# EAGLE board All-in-one Starter Kit for Arduino Nano R4 V1.0 (EAGLE 9.6.2)
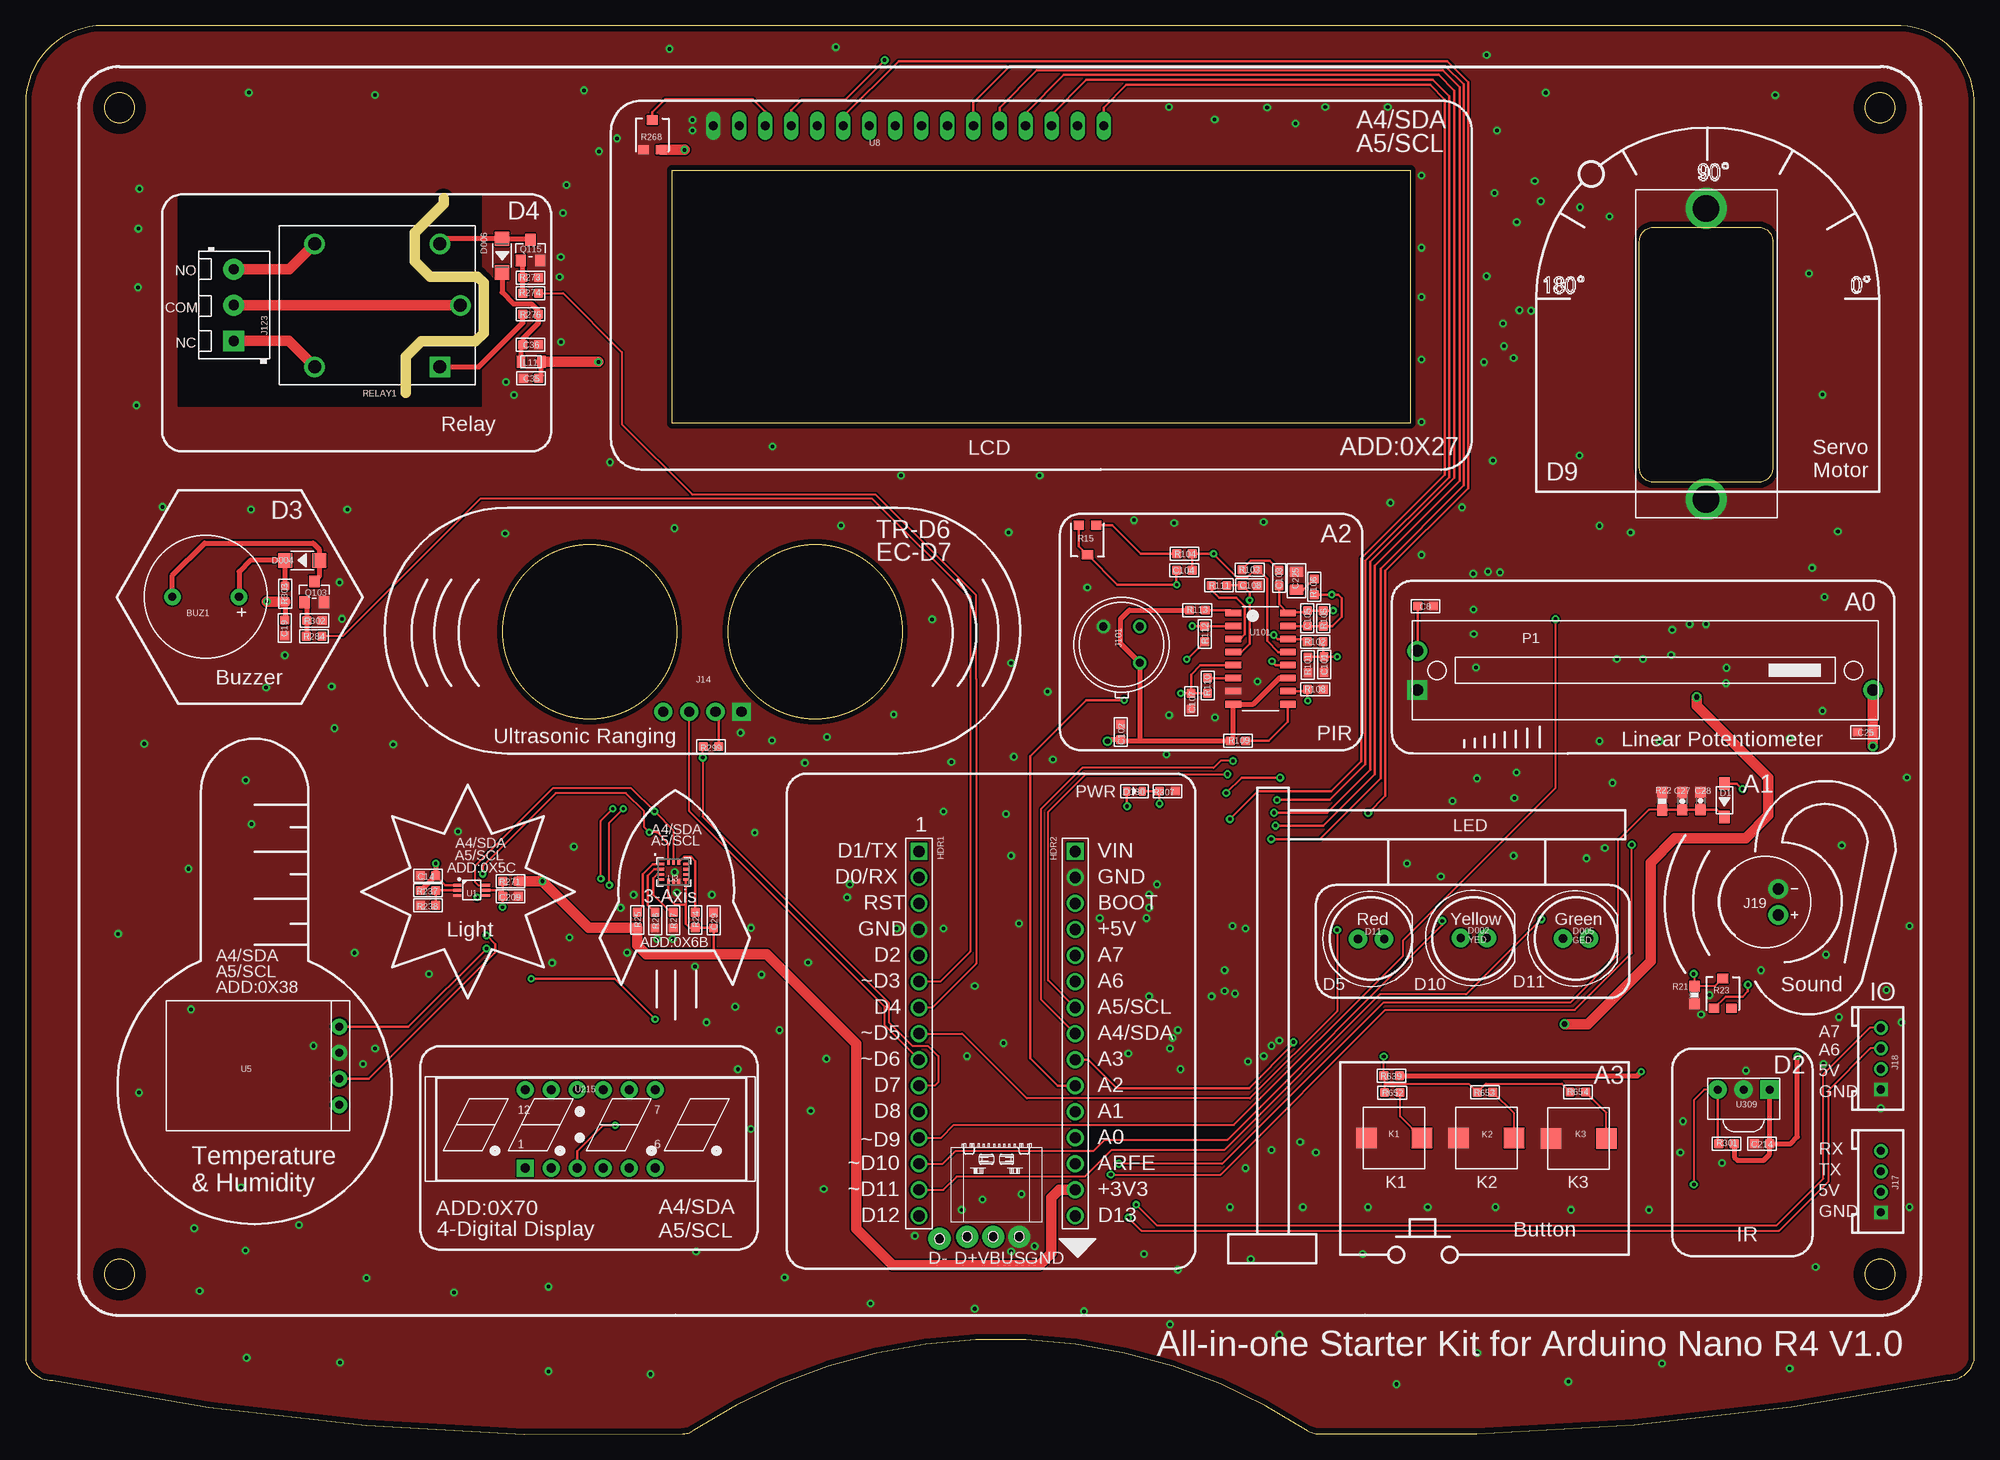
[diagram p2: board, top side]
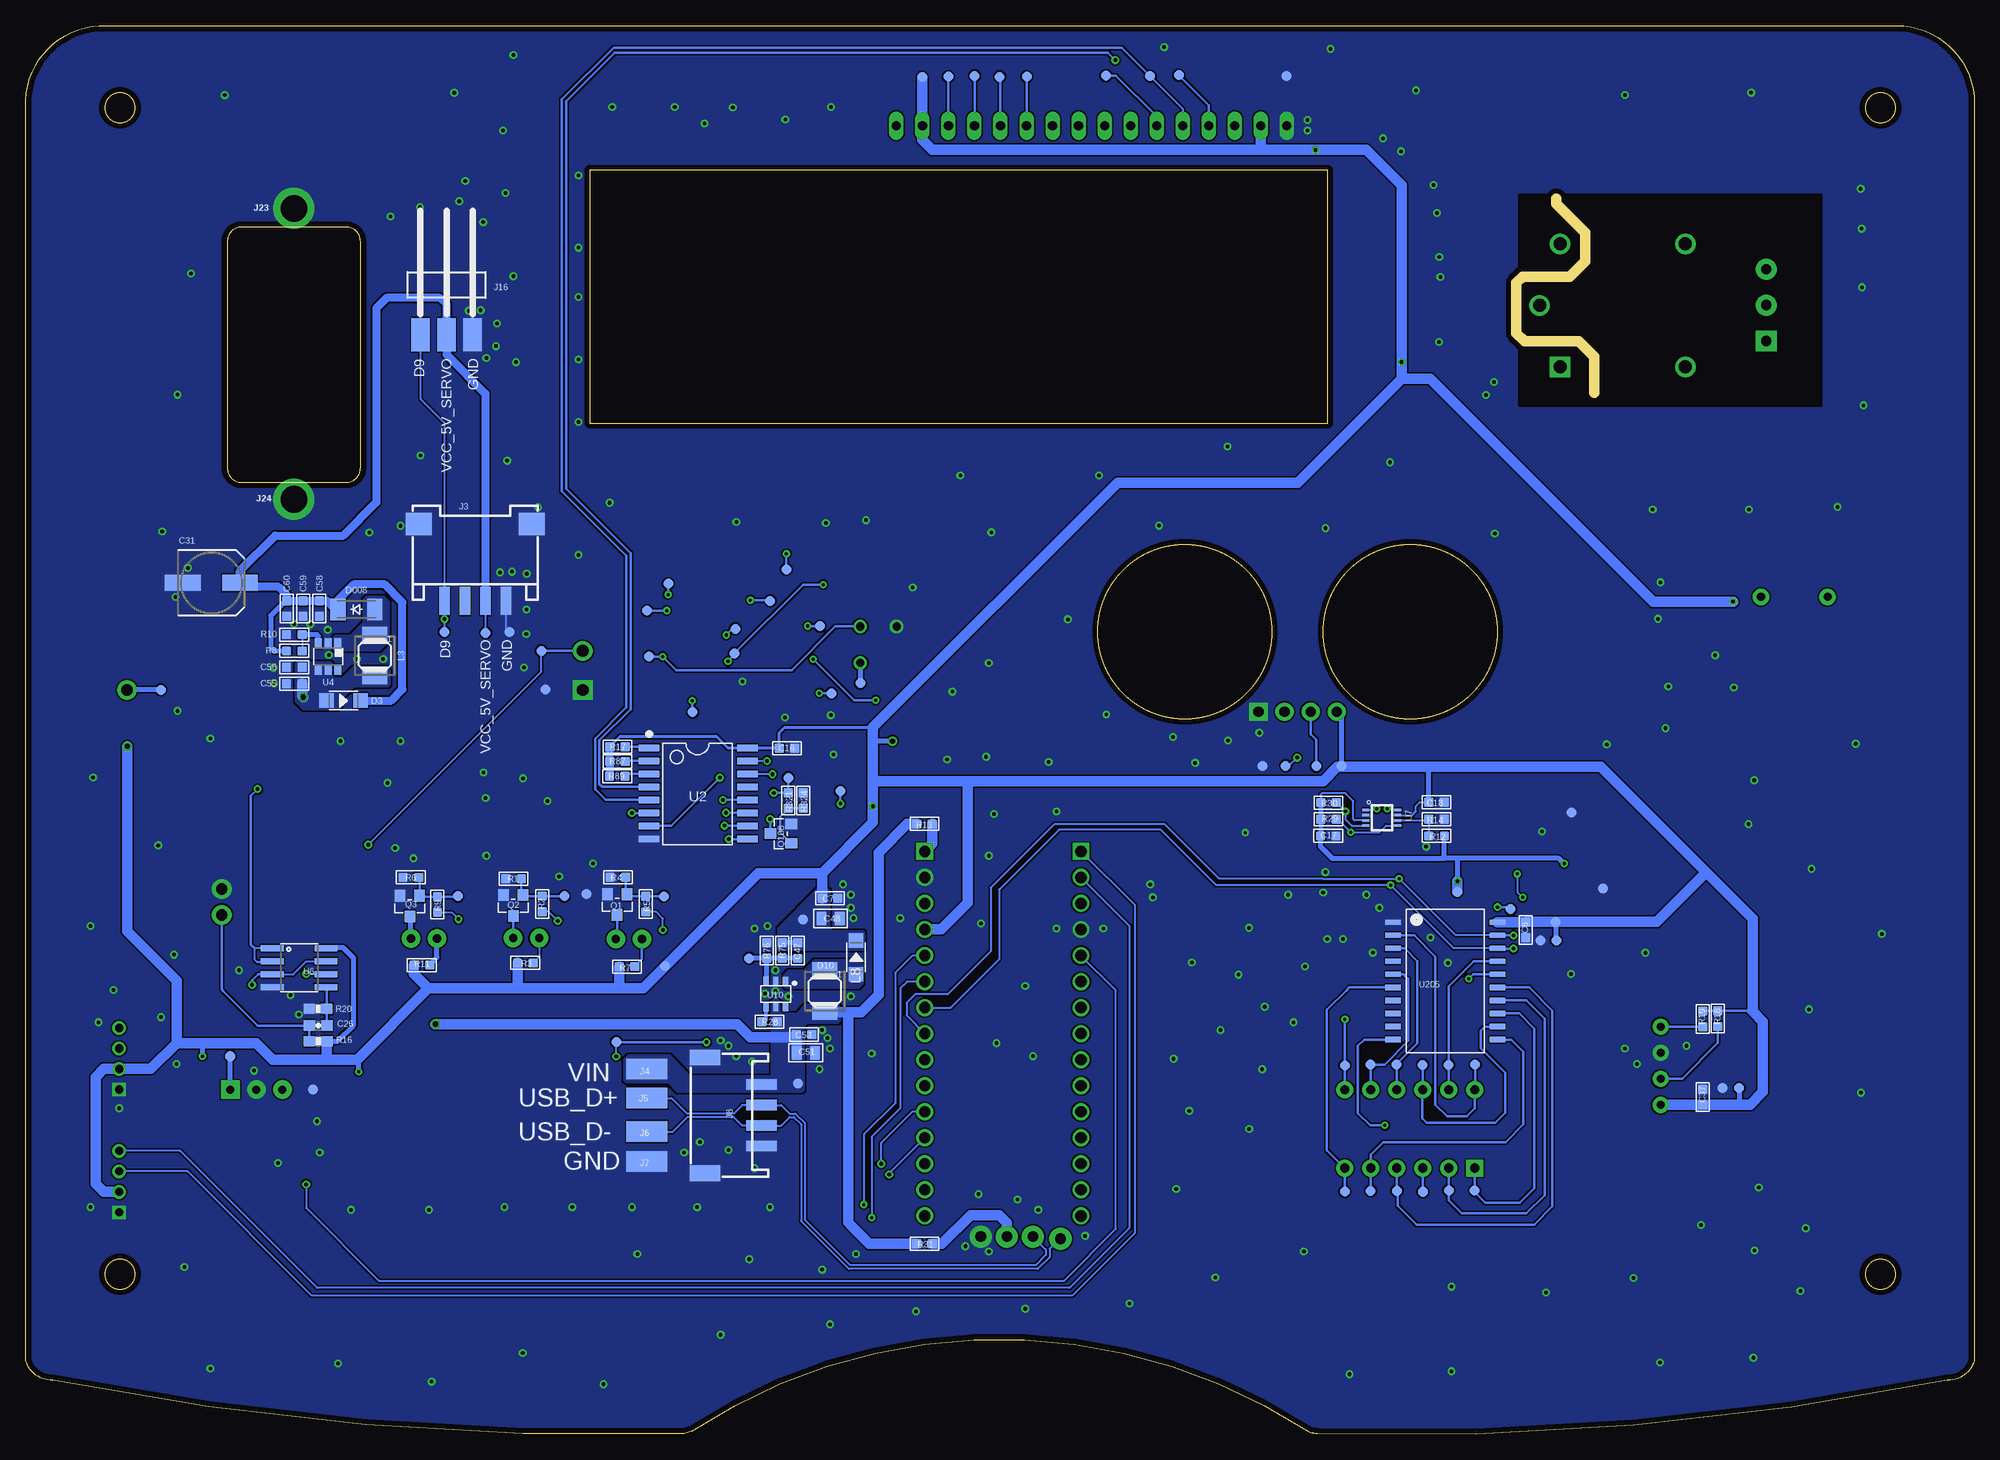
[diagram p3: board, bottom side, seen from below]

Size 190.12 x 137.4 mm. Coordinates in mm from the lower left corner, seen from the top.
Outline: 37.08,101.61 37.08,105.11 38.58,106.61 43.78,106.61
Outline: 44.68,112.31 44.08,112.91 39.48,112.91 37.98,114.41 37.98,117.21 40.78,120.01 40.78,120.51
Outline: 44.68,112.21 44.68,107.41 43.88,106.61
Outline: 190.12,7.17 190.12,129.4 arc90 182.92,137.4 7.59,137.4 arc90 0,129.81 0,7.17 arc74 2.63,5.24 arc13 64.11,0.02 arc30 65.1,0.3 arc-66 125.16,0.28 arc30 126.16,0.02 arc13 187.46,5.24 arc74 190.12,7.17
Outline: 170.45,116.35 170.45,94.25 arc-90 169.05,92.85 158.85,92.85 arc-90 157.45,94.25 157.45,116.35 arc-90 158.85,117.75 169.05,117.75 arc-90 170.45,116.35
Outline: circle at 9.16,15.58 radius 1.45
Outline: circle at 9.16,129.39 radius 1.45
Outline: circle at 180.92,15.58 radius 1.45
Outline: circle at 180.92,129.39 radius 1.45
Copper layers (1*16): Top 0.035mm / dielectric 1.5mm / Bottom 0.035mm
Design rules "default *": minimum track width 8mil, minimum drill 0.3mm, track to track 6mil, track to pad 6mil, pad to pad 6mil, via to via 6mil, smd to smd 0mil, copper to edge 20mil, drill to drill 6mil, minimum pad ring 10mil, minimum via ring 8mil, stop-mask expansion 4mil, vias tented up to drill 100mil, thermal gap 0mil
Net classes: 1 PWR: width 0.15 mm, drill 0.25 mm; 2 gnd: width 0.15 mm, drill 0.3 mm, clearance 0.152 mm
tKeepout: area 147.3,94 to 180.9,127.6
tRestrict: area 6.7,13.1 to 11.7,18.1; area 6.7,126.9 to 11.7,131.9; area 178.4,13.1 to 183.4,18.1; area 178.4,126.9 to 183.4,131.9

## Footprints (pad centres in the part's own frame; a part is rotated, then mirrored left to right if it is on the bottom)
BUZZER-D12MM-DIP2 = drill 0.8 pad 1.6: 1 -3.25,0; 2 3.25,0
0603 = smd 0.889 x 0.889: 1 -0.762,0; 2 0.762,0
C0603 = smd 0.889 x 0.889: 1 -0.762,0; 2 0.762,0
0603-CAP = smd 1.1 x 1: 1 -0.85,0; 2 0.85,0
SANYO-OSCON_SMD_C6 = smd 3.5 x 1.6: + 2.8,0; - -2.8,0
C0805 = smd 1.016 x 1.397: 1 -0.889,0; 2 0.889,0
0805 = smd 1.016 x 1.397: 1 -0.889,0; 2 0.889,0
SOD123-2.7X1.6 = smd 1.2 x 1.02: 1 -1.635,0; 2 1.635,0
LED-8MM = drill 0.8 pad 1.8: 1 -1.27,0; 2 1.27,0
D_SOD123FL = smd 1.397 x 1.397: + -1.651,0; - 1.651,0
D_SOD123 = smd 1.397 x 1.397: + -1.651,0; - 1.651,0
SOD-123_MINI-SMA = smd 1.5 x 2.1: A 1.8,0; C -1.8,0
LED_0603_SMT = smd 0.762 x 0.889: 1 -0.762,0; 2 0.762,0
HDR-TH_15P-P2.54-V-F = drill 1.1 square: 1 0,0 | drill 1.1: 2 2.54,0; 3 5.08,0; 4 7.62,0; 5 10.16,0; 6 12.7,0; 7 15.24,0; 8 17.78,0; 9 20.32,0; 10 22.86,0; 11 25.4,0; 12 27.94,0; 13 30.48,0; 14 33.02,0; 15 35.56,0
A_XBJ_CONNECTOR_4P-SMD-2.0-90D = smd 1.01 x 2.74: 1 -3,-0.1; 2 -1,-0.1; 3 1,-0.1; 4 3,-0.1 | smd 2.54 x 2.184: SS1 -5.5,7.4; SS2 5.5,7.4
TP-SMD-2X4MM = smd 4 x 2: 1 0,0
PH2.0-4P = smd 1 x 3: 1 -3,2.762; 2 -1,2.762; 3 1,2.762; 4 3,2.762 | smd 1.524 x 3: 5 -5.65,-2.763; 6 5.65,-2.763
CROWPI_POW_ULTRA = drill 1 pad 1.778 square: P$1 3.81,0 | drill 1 pad 1.778: P$2 1.27,0; P$3 -1.27,0; P$4 -3.81,0
CON-PZ-2.54MM-1*3P-WT = smd 1.8 x 3.2: 1 -2.54,0; 2 0,0; 3 2.54,0
2.0_1X4 = drill 0.8 pad 1.27 square: 1 -3,0 | drill 0.8 pad 1.27: 2 -1,0; 3 1,0; 4 3,0
TEMPLATE_2P-D8.9MM = drill 1.1 pad 1.93: 1 -1.27,1.27; 2 -1.27,-1.27
1X01_2.6MM = drill 2.6 pad 4: 1 0,0
3P-D8.1MM = drill 0.8: 1 1.778,1.778; 2 -1.778,1.778; 3 -1.778,-1.778
3.5MM*3P = drill 1.016 pad 2.032 square: 1 -3.5,0 | drill 1.016 pad 2.032: 2 0,0; 3 3.5,0
BUTTON_2P = smd 2 x 2: P$1 0.3,0; P$2 5.7,0
MS42 = smd 2.4 x 1.5: 1 0,2.05; 2 0,-2.05
201209 = smd 0.8 x 1.2: 1 -1,0; 2 1,0
3P-SQUA-45.6X10X5.8H = drill 1.143 pad 1.905 square: 1 -22.225,-1.905 | drill 1.143 pad 1.905: 2 -22.225,1.905; 3 22.225,-1.905
PAD-1.0MM = smd 1 x 1: P$1 0,0
SOT23@1 = smd 1.016 x 1.143: 1 -0.95,-1.016; 2 0.95,-1.016; 3 0,1.016
R0603 = smd 0.889 x 0.889: 1 -0.762,0; 2 0.762,0
3P-SMD-SQUA-3.6X3.3 = smd 1 x 0.9: 1 -0.85,-1.45; 3 0.85,-1.45 | smd 1.1 x 0.9: 2 0,1.45
0603-RES = smd 1.1 x 1: 1 -0.85,0; 2 0.85,0
R0603-SP = smd 0.889 x 0.889: 1 -0.762,0; 2 0.762,0
REY5-6-19.1X15.5X15.3MM = drill 1.3 pad 2 square: 1 -6.1,6 | drill 1.3 pad 2: 2 -8.1,0; 3 -6.1,-6; 4 6.1,6; 5 6.1,-6
POGOPIN_4 = drill 1.05 pad 2.15: 1 0,0; 2 2.54,0; 3 5.08,0; 4 7.769,0.214
BH1750-WSOF-6 = smd 0.8 x 0.27: 1 -1.4,0.5; 2 -1.4,0; 3 -1.4,-0.5; 4 1.4,-0.5; 5 1.4,0; 6 1.4,0.5
SO-16-300MIL = smd 0.635 x 2: P$1 0,0; P$2 1.27,0; P$3 2.54,0; P$4 3.81,0; P$5 5.08,0; P$6 6.35,0; P$7 7.62,0; P$8 8.89,0; P$9 8.89,9.6; P$10 7.62,9.6; P$11 6.35,9.6; P$12 5.08,9.6; P$13 3.81,9.6; P$14 2.54,9.6; P$15 1.27,9.6; P$16 0,9.6
LGA-14L = smd 0.475 x 0.25: 1 -1.163,0.75; 2 -1.163,0.25; 3 -1.163,-0.25; 4 -1.163,-0.75; 8 1.163,-0.75; 9 1.163,-0.25; 10 1.163,0.25; 11 1.163,0.75 | smd 0.25 x 0.475: 5 -0.5,-0.912; 6 0,-0.912; 7 0.5,-0.912; 12 0.5,0.912; 13 0,0.912; 14 -0.5,0.912
DBV_R-PDSO-G6 = smd 0.69 x 0.99: 1 -0.95,-1.29; 2 0,-1.29; 3 0.95,-1.29; 4 0.95,1.3; 5 0,1.3; 6 -0.95,1.3
CROWTAIL-DHT20-V1.0-20211013_DHT20 = drill 0.8 pad 1.6: 1 -3.81,0; 2 -1.27,0; 3 1.27,0; 4 3.81,0
SO08 = smd 0.61 x 2.21: 1 -1.905,-2.616; 2 -0.635,-2.616; 3 0.635,-2.616; 4 1.905,-2.616; 5 1.905,2.616; 6 0.635,2.616; 7 -0.635,2.616; 8 -1.905,2.616
VSSOP-8 = smd 0.25 x 0.7: 1 -0.762,-1.55; 2 -0.254,-1.55; 3 0.254,-1.55; 4 0.762,-1.55; 5 0.762,1.55; 6 0.254,1.55; 7 -0.254,1.55; 8 -0.762,1.55
CROWPI_POW_LCD1206 = drill 0.9 long: P$1 -16.51,3.36; P$2 -13.97,3.36; P$3 -11.43,3.36; P$4 -8.89,3.36; P$5 -6.35,3.36; P$6 -3.81,3.36; P$7 -1.27,3.36; P$8 1.27,3.36; P$9 3.81,3.36; P$10 6.35,3.36; P$11 8.89,3.36; P$12 11.43,3.36; P$13 13.97,3.36; P$14 16.51,3.36; P$15 19.05,3.36; P$16 21.59,3.36
SOT23-6L = smd 0.5 x 0.9: 1 -0.961,-1.212; 2 -0.011,-1.212; 3 0.94,-1.212; 4 0.94,1.288; 5 -0.011,1.288; 6 -0.961,1.288
SOP16 = smd 0.635 x 1.524: 1 0,0; 2 1.27,0; 3 2.54,0; 4 3.81,0; 5 5.08,0; 6 6.35,0; 7 7.62,0; 8 8.89,0; 9 8.89,5.334; 10 7.62,5.334; 11 6.35,5.334; 12 5.08,5.334; 13 3.81,5.334; 14 2.54,5.334; 15 1.27,5.334; 16 0,5.334
HT16K33-SOP20 = smd 1.5 x 0.5: P$1 -5.08,5.08; P$2 -5.08,3.81; P$3 -5.08,2.54; P$4 -5.08,1.27; P$5 -5.08,0; P$6 -5.08,-1.27; P$7 -5.08,-2.54; P$8 -5.08,-3.81; P$9 -5.08,-5.08; P$10 -5.08,-6.35; P$11 5.12,-6.35; P$12 5.12,-5.08; P$13 5.12,-3.81; P$14 5.12,-2.54; P$15 5.12,-1.27; P$16 5.12,0; P$17 5.12,1.27; P$18 5.12,2.54; P$19 5.12,3.81; P$20 5.12,5.08
4-DIGITAL_DISPLAY = drill 0.889 pad 1.651 square: 1 -5.964,-4.229 | drill 0.889 pad 1.651: 2 -3.424,-4.229; 3 -0.884,-4.229; 4 1.656,-4.229; 5 4.196,-4.229; 6 6.736,-4.229; 7 6.736,3.391; 8 4.196,3.391; 9 1.656,3.391; 10 -0.884,3.391; 11 -3.424,3.391; 12 -5.964,3.391
VS1838B-SIP3 = drill 0.8 pad 1.8 square: 1 -2.54,0 | drill 0.8 pad 1.8: 2 0,0; 3 2.54,0

## Placement (x,y rotation side)
BUZ1  BUZZER_1295  [BUZZER-D12MM-DIP2]  17.57,81.68 180 top
C6  100nF  [0603]  43.77,49.17 90 bottom
C7  1uF  [C0603]  111.66,52.29 180 bottom
C8  1uF  [C0603]  136.58,80.78 180 top
C14  1uF  [0603]  39.25,54.47 0 top
C16  100nF  [0603]  115.83,66.91 180 bottom
C17  100nF  [0603]  63.04,58.35 0 bottom
C18  100nF  [0603]  52.47,61.65 180 bottom
C19  100nF  [0603]  25.29,78.65 270 top
C25  100nF  [C0603]  179.46,68.49 0 top
C26  0.1uF  [0603-CAP]  161.58,39.86 0 bottom
C27  0.1uF  [0603-CAP]  161.62,61.75 270 top
C28  0.1uF  [0603-CAP]  163.39,61.77 270 top
C29  100nF  [C0603]  67.12,50.13 270 top
C31  100UF  [SANYO-OSCON_SMD_C6]  172.01,83.05 0 bottom
C35  100nF  [C0603]  49.3,103 0 top
C36  100nF  [C0603]  49.27,106.26 180 top
C37  100nF  [0603]  26.51,32.87 270 bottom
C47  22pF  [C0603]  114.81,47.16 270 bottom
C48  22uF  [C0805]  111.59,50.29 180 bottom
C51  47uF  [C0805]  114,37.18 180 bottom
C53  1uF  [C0603]  114.18,38.98 180 bottom
C55  NC/22UF/16V  [C0603]  163.91,73.2 0 bottom
C56  NC/100NF  [C0603]  163.91,74.8 0 bottom
C58  NC/22UF/16V  [C0603]  161.46,80.55 90 bottom
C59  NC/22UF/16V  [C0603]  163.06,80.55 90 bottom
C60  NC/100NF  [C0603]  164.66,80.55 90 bottom
C101  10nF  [C0603]  126.67,75.07 90 top
C102  10nF  [C0603]  106.83,68.49 270 top
C103  10uF  [0603]  122.28,83.52 270 top
C104  22nF  [C0603]  113.04,84.27 180 top
C105  22nF  [C0603]  125.05,79.59 270 top
C107  10nF  [C0603]  113.7,71.49 270 top
C108  10nF  [C0603]  119.44,82.79 0 top
C209  100nF  [0603]  47.3,52.47 180 top
C214  4.7uF  [0603]  169.39,28.33 0 top
C225  47uF  [0805]  124,83.25 270 top
D1  MBR0520  [SOD123-2.7X1.6]  165.73,61.82 270 top
D002  YED  [LED-8MM]  141.28,48.4 0 top
D3  DSS34  [D_SOD123FL]  159.11,71.55 0 bottom
D004  1N4148  [D_SOD123]  26.99,85.23 180 top
D005  GED  [LED-8MM]  151.26,48.35 0 top
D006  1N4148  [D_SOD123]  46.48,114.97 270 top
D008  NC/B5819W  [SOD-123_MINI-SMA]  157.86,80.45 0 bottom
D10  DSS34  [D_SOD123FL]  109.1,46.51 90 bottom
D11  RED  [LED-8MM]  131.26,48.3 0 top
D130  RED  [LED_0603_SMT]  108.17,62.72 0 top
HDR1  KH-2.54FH-1X15P-H8.5  [HDR-TH_15P-P2.54-V-F]  87.16,56.84 270 top
HDR2  KH-2.54FH-1X15P-H8.5  [HDR-TH_15P-P2.54-V-F]  102.39,56.84 270 top
J3  [A_XBJ_CONNECTOR_4P-SMD-2.0-90D]  146.26,81.39 0 bottom
J4  TP-SMDTP-SMD-2X4MM  [TP-SMD-2X4MM]  129.5,35.6 0 bottom
J5  TP-SMDTP-SMD-2X4MM  [TP-SMD-2X4MM]  129.5,32.78 0 bottom
J6  TP-SMDTP-SMD-2X4MM  [TP-SMD-2X4MM]  129.5,29.5 0 bottom
J7  TP-SMDTP-SMD-2X4MM  [TP-SMD-2X4MM]  129.5,26.57 0 bottom
J8  PH2.0-4P-WOTIE  [PH2.0-4P]  121.08,31.09 270 bottom
J14  CROWPI_POW_ULTRA  [CROWPI_POW_ULTRA]  66.02,70.47 0 top
J16  CON-2.54MM-3P  [CON-PZ-2.54MM-1*3P-WT]  149.06,107.25 0 bottom
J17  TWIG_2.0  [2.0_1X4]  180.99,24.62 90 top
J18  TWIG_2.0  [2.0_1X4]  180.99,36.62 90 top
J19  SOUND  [TEMPLATE_2P-D8.9MM]  169.72,51.91 180 top
J23  [1X01_2.6MM]  163.95,119.56 0 bottom
J24  [1X01_2.6MM]  163.95,91.2 0 bottom
J101  LHI778  [3P-D8.1MM]  106.92,77.01 270 top
J123  3.5MM3P  [3.5MM*3P]  20.31,110.14 90 top
K1  BUTTON_2P  [BUTTON_2P]  130.52,28.86 0 top
K2  BUTTON_2P  [BUTTON_2P]  139.51,28.88 0 top
K3  BUTTON_2P  [BUTTON_2P]  148.52,28.84 0 top
L3  NC/10UH  [MS42]  156.06,75.95 180 bottom
L8  10UH  [MS42]  112.16,43.21 180 bottom
L11  0R  [201209]  49.33,104.61 180 top
P1  10K  [3P-SQUA-45.6X10X5.8H]  157.99,74.5 0 top
P2  PADPAD-1.0MM  [PAD-1.0MM]  114.75,34.18 90 bottom
P3  PADPAD-1.0MM  [PAD-1.0MM]  102.63,132.39 90 bottom
P4  PADPAD-1.0MM  [PAD-1.0MM]  119.54,46.4 90 bottom
P5  PADPAD-1.0MM  [PAD-1.0MM]  110.64,62.73 90 bottom
P6  PADPAD-1.0MM  [PAD-1.0MM]  132.48,38.25 0 bottom
P7  PADPAD-1.0MM  [PAD-1.0MM]  137.56,52.48 0 bottom
P30  PADPAD-1.0MM  [PAD-1.0MM]  147.95,52.48 0 bottom
P36  PADPAD-1.0MM  [PAD-1.0MM]  61.74,65.17 0 bottom
P37  PADPAD-1.0MM  [PAD-1.0MM]  64.2,65.17 0 bottom
P38  PADPAD-1.0MM  [PAD-1.0MM]  67.19,65.18 0 bottom
P39  PADPAD-1.0MM  [PAD-1.0MM]  69.44,65.17 0 bottom
P40  PADPAD-1.0MM  [PAD-1.0MM]  127.72,45.65 0 bottom
P42  PADPAD-1.0MM  [PAD-1.0MM]  127.86,52.45 0 bottom
P43  PADPAD-1.0MM  [PAD-1.0MM]  135.39,52.68 0 bottom
P48  PADPAD-1.0MM  [PAD-1.0MM]  170.16,36.85 0 bottom
P49  PADPAD-1.0MM  [PAD-1.0MM]  50.43,52.9 0 bottom
P50  PADPAD-1.0MM  [PAD-1.0MM]  162.07,33.64 0 bottom
P51  PADPAD-1.0MM  [PAD-1.0MM]  45.23,51.21 0 bottom
P52  PADPAD-1.0MM  [PAD-1.0MM]  36.23,53.21 0 bottom
P54  PADPAD-1.0MM  [PAD-1.0MM]  22.95,33.75 180 bottom
P55  PADPAD-1.0MM  [PAD-1.0MM]  114.3,50.21 0 bottom
P56  PADPAD-1.0MM  [PAD-1.0MM]  24.57,33.75 180 bottom
P57  PADPAD-1.0MM  [PAD-1.0MM]  67.12,132.51 0 bottom
P58  PADPAD-1.0MM  [PAD-1.0MM]  77.61,132.58 0 bottom
P59  PADPAD-1.0MM  [PAD-1.0MM]  80.41,132.47 0 bottom
P60  PADPAD-1.0MM  [PAD-1.0MM]  84.72,132.54 0 bottom
P61  PADPAD-1.0MM  [PAD-1.0MM]  115.71,64.02 90 bottom
P62  PADPAD-1.0MM  [PAD-1.0MM]  92.44,132.44 0 bottom
P63  PADPAD-1.0MM  [PAD-1.0MM]  95.1,132.41 0 bottom
P64  PADPAD-1.0MM  [PAD-1.0MM]  97.53,132.49 0 bottom
P65  PADPAD-1.0MM  [PAD-1.0MM]  100.09,132.43 0 bottom
P73  PADPAD-1.0MM  [PAD-1.0MM]  40.77,48.17 0 bottom
P74  PADPAD-1.0MM  [PAD-1.0MM]  42.33,48.17 0 bottom
P75  PADPAD-1.0MM  [PAD-1.0MM]  51.28,36.02 0 bottom
P76  PADPAD-1.0MM  [PAD-1.0MM]  61.42,35.96 0 bottom
P77  PADPAD-1.0MM  [PAD-1.0MM]  56.33,23.72 0 bottom
P78  PADPAD-1.0MM  [PAD-1.0MM]  51.26,23.76 0 bottom
P79  PADPAD-1.0MM  [PAD-1.0MM]  48.74,23.75 0 bottom
P80  PADPAD-1.0MM  [PAD-1.0MM]  53.82,36.01 0 bottom
P81  PADPAD-1.0MM  [PAD-1.0MM]  58.89,23.72 0 bottom
P82  PADPAD-1.0MM  [PAD-1.0MM]  53.81,23.64 0 bottom
P83  PADPAD-1.0MM  [PAD-1.0MM]  40.84,49.96 0 bottom
P84  PADPAD-1.0MM  [PAD-1.0MM]  48.71,36.04 0 bottom
P85  PADPAD-1.0MM  [PAD-1.0MM]  56.36,36.04 0 bottom
P86  PADPAD-1.0MM  [PAD-1.0MM]  58.89,36.04 0 bottom
P87  PADPAD-1.0MM  [PAD-1.0MM]  61.42,23.64 0 bottom
P88  PADPAD-1.0MM  [PAD-1.0MM]  39.29,60.64 0 bottom
P89  PADPAD-1.0MM  [PAD-1.0MM]  176.92,72.6 0 bottom
P90  PADPAD-1.0MM  [PAD-1.0MM]  139.81,76.39 0 bottom
P91  PADPAD-1.0MM  [PAD-1.0MM]  139.41,72.65 0 bottom
P92  PADPAD-1.0MM  [PAD-1.0MM]  145.25,78.17 0 bottom
P93  PADPAD-1.0MM  [PAD-1.0MM]  149.27,78.25 0 bottom
P94  PADPAD-1.0MM  [PAD-1.0MM]  142.92,78.27 0 bottom
P95  PADPAD-1.0MM  [PAD-1.0MM]  129.28,75.86 0 bottom
P96  PADPAD-1.0MM  [PAD-1.0MM]  112.64,78.81 0 bottom
P97  PADPAD-1.0MM  [PAD-1.0MM]  108.69,73.27 0 bottom
P98  PADPAD-1.0MM  [PAD-1.0MM]  125.05,70.43 0 bottom
P99  PADPAD-1.0MM  [PAD-1.0MM]  120.96,76.17 0 bottom
P100  PADPAD-1.0MM  [PAD-1.0MM]  129.48,80.33 0 bottom
P101  PADPAD-1.0MM  [PAD-1.0MM]  115.9,84.36 0 bottom
P102  PADPAD-1.0MM  [PAD-1.0MM]  120.88,78.55 0 bottom
P103  PADPAD-1.0MM  [PAD-1.0MM]  127.42,82.96 0 bottom
P104  PADPAD-1.0MM  [PAD-1.0MM]  117.49,81.29 0 bottom
P105  PADPAD-1.0MM  [PAD-1.0MM]  111.52,72.27 0 bottom
Q1  S9013  [SOT23@1]  132.41,51.65 180 bottom
Q2  S9013  [SOT23@1]  142.54,51.56 180 bottom
Q3  S9013  [SOT23@1]  152.63,51.5 180 bottom
Q103  S9013  [SOT23@1]  28.17,82.17 0 top
Q108  S9013  [SOT23@1]  116.45,58.58 90 bottom
Q115  S9013  [SOT23@1]  49.26,115.5 0 top
R1  10K  [R0603]  142.51,54.18 0 bottom
R2  1K  [R0603]  139.72,51.72 270 bottom
R3  470R  [R0603]  141.37,45.96 0 bottom
R4  10K  [R0603]  132.34,54.31 0 bottom
R5  1K  [R0603]  129.62,51.7 270 bottom
R6  10K  [R0603]  152.54,54.3 0 bottom
R7  470R  [R0603]  131.46,45.61 0 bottom
R8  NC/95.3K  [R0603]  163.91,76.4 0 bottom
R9  1K  [R0603]  149.94,51.66 270 bottom
R10  NC/13K  [R0603]  163.91,78 180 bottom
R11  100R  [R0603]  151.47,45.76 0 bottom
R12  10K  [R0603]  52.46,58.35 180 bottom
R13  NC  [R0603]  102.42,59.52 180 bottom
R14  NC  [R0603]  52.47,59.96 180 bottom
R15  500K  [3P-SMD-SQUA-3.6X3.3]  103.6,87.22 180 top
R16  10k  [0603-RES]  161.58,38.31 0 bottom
R17  10K  [R0603]  132.37,67.06 0 bottom
R18  4.7K  [R0603]  25.02,40.52 270 bottom
R19  4.7K  [R0603]  26.5,40.5 270 bottom
R20  10k  [0603-RES]  161.61,41.48 0 bottom
R21  2.2k  [0603-RES]  162.82,42.83 90 top
R22  100k  [0603-RES]  159.68,61.74 90 top
R23  500k  [3P-SMD-SQUA-3.6X3.3]  165.57,42.98 0 top
R24  4.7K  [R0603]  65.34,50.15 270 top
R25  4.7K  [R0603]  59.66,50.16 270 top
R26  4.7K  [R0603]  61.41,50.13 90 top
R27  4.7K  [R0603]  63.19,50.13 90 top
R28  10K  [R0603-SP]  117.54,40.23 180 bottom
R29  4.7K  [R0603]  63.02,59.99 0 bottom
R30  4.7K  [R0603]  63.01,61.61 0 bottom
R31  NC  [R0603]  102.42,18.57 180 bottom
R75  95.3K 1%  [R0603-SP]  116.31,47.17 90 bottom
R76  12.4K 1%  [R0603-SP]  117.82,47.18 270 bottom
R87  10K  [R0603]  132.39,65.61 0 bottom
R89  10K  [R0603]  132.4,64.17 0 bottom
R101  10K  [R0603]  125.1,75.04 90 top
R102  0R  [R0603]  125.81,77.3 0 top
R103  1K  [R0603]  119.43,84.33 0 top
R104  130K  [R0603]  113.06,85.88 0 top
R105  1M_1%  [R0603]  126.58,79.57 270 top
R106  3.3K  [R0603]  125.7,82.66 270 top
R108  1M  [R0603]  125.82,72.66 180 top
R109  10K  [R0603]  118.27,67.62 0 top
R110  4.7M  [R0603]  115.31,73.03 90 top
R111  10K  [R0603]  116.44,82.79 0 top
R112  2K  [R0603]  115.05,78.05 90 top
R113  10K  [R0603]  114.31,80.39 0 top
R237  10K  [R0603]  39.26,53.03 180 top
R238  NC  [R0603]  39.25,51.59 0 top
R268  10K  [3P-SMD-SQUA-3.6X3.3]  61.14,126.74 0 top
R271  10K  [R0603]  47.3,53.93 180 top
R273  10K  [R0603]  49.27,112.83 180 top
R274  1K  [R0603]  49.27,111.3 0 top
R276  22R  [R0603]  49.27,109.26 180 top
R284  2K  [R0603]  28.15,77.84 180 top
R299  2K  [R0603]  66.86,67.07 180 top
R301  10K  [R0603]  165.94,28.33 180 top
R302  10K  [R0603]  28.18,79.37 180 top
R303  22R  [R0603]  25.31,81.98 90 top
R307  4.7K  [R0603]  111.38,62.73 0 top
R321  1K  [R0603]  115.71,61.8 90 bottom
R324  10K  [R0603]  114.25,61.81 90 bottom
R639  2K  [R0603]  133.27,34.95 180 top
R652  2K  [R0603]  133.33,33.32 180 top
R653  4.02K  [R0603]  142.39,33.35 180 top
R654  10K  [R0603]  151.44,33.37 180 top
RELAY1  [REY5-6-19.1X15.5X15.3MM]  34.31,110.12 180 top
TEST_PIN1  POGOPIN_4  [POGOPIN_4]  96.93,19.26 180 top
U1  [BH1750-WSOF-6]  43.52,53.04 0 top
U2  PCF8574DWR(UMW)  [SO-16-300MIL]  129.3,66.94 270 bottom
U3  LSM6DS3  [LGA-14L]  63.22,54.85 0 top
U4  NC/MT3608  [DBV_R-PDSO-G6]  160.61,75.85 180 bottom
U5  DHT20  [CROWTAIL-DHT20-V1.0-20211013_DHT20]  30.6,35.93 90 top
U6  LMV358  [SO08]  163.44,45.49 270 bottom
U7  TXS0102DCUR  [VSSOP-8]  57.81,60.12 270 bottom
U8  CROWPI_POW_LCD1602  [CROWPI_POW_LCD1206]  83.58,124.28 0 top
U10  MT3608  [SOT23-6L]  116.95,42.96 180 bottom
U101  BIS0001  [SOP16]  117.81,80.09 270 top
U205  HT16K33-20P  [HT16K33-SOP20]  51.65,44.84 0 bottom
U215  YY2841AS-33  [4-DIGITAL_DISPLAY]  54.69,30.18 0 top
U309  IR-3PSIP3  [VS1838B-SIP3]  167.61,33.59 180 top

## Tracks (layer width: path | path; a pad name or v marks a point on that pad's centre or on a via)
1IN+  (via drill 0.3 pad 0.7)
  Top 0.254: v121.76,77.95 122.17,77.55 U101.14 124.8,77.55 R102.1
  Bottom 0.254: v121.76,77.95 121.17,78.55 P102.P$1
1IN-  (via drill 0.3 pad 0.7)
  Top 0.254: U101.15 125.05,78.82 C105.2 125.07,78.8 R105.2 127.48,78.8 128.4,79.72 128.4,81.54 128.04,81.89 v127.44,81.89 R106.2
  Bottom 0.254: P103.P$1 127.44,82.94 v127.44,81.89
1OUT  (via drill 0.3 pad 0.7)
  Top 0.254: C103.2 122.28,80.95 U101.16 123.24,80.18 124.88,80.18 C105.1 125.07,80.33 R105.1 v127.57,80.33
  Bottom 0.254: v127.57,80.33 P100.P$1
2IN-  (via drill 0.3 pad 0.7)
  Top 0.254: U101.13 122.21,76.28 121.11,77.38 121.11,83.45 120.23,84.33 R103.2 119.95,84.33 119.2,83.59 118.16,83.59 115.9,85.85 v115.9,85.88 R104.2 113.82,84.29 C104.1
  Bottom 0.254: P101.P$1 v115.9,85.87 v115.9,85.88
2OUT  (via drill 0.3 pad 0.7)
  Top 0.254: U101.12 121.98,75.01 v121.6,75.39 | C104.2 112.28,82.89 v112.31,82.86 106.51,82.86 R15.2 102.75,86.62 R15.3
  Bottom 0.254: v121.6,75.39 120.96,76.02 P99.P$1 114.27,82.86 v112.31,82.86
A
  Bottom 0.254: U205.P$17 48.84,46.11 51.28,43.66 P75.P$1 51.28,33.58 U215.11
A0_ROTARY  (via drill 0.35)
  Top 0.203: v105.86,25.31 116.58,25.31 132.66,41.39 151.15,41.39 156.7,46.94 v156.7,57.49
  Top 0.254: C8.2 135.82,76.46 P1.2
  Bottom 0.203: HDR2.12 105.86,25.44 v105.86,25.31 | v156.7,57.49 139.81,74.37 P90.P$1
  Bottom 0.254: P90.P$1 135.78,76.39 P1.2
A1_SOUND  (via drill 0.35)
  Top 0.203: R22.1 158.36,60.89 155.34,57.87 155.34,46.75 150.68,42.09 132.46,42.09 116.74,26.37 v106.65,26.37
  Top 0.254: D1.2 165,60.92 C28.2 161.63,60.92 C27.2 159.69,60.9 R22.1
  Bottom 0.203: v106.65,26.37 106.65,28.4 103.6,31.44 HDR2.11
A2_PIR  (via drill 0.3 pad 0.7)
  Top 0.254: R112.1 113.34,75.58 v113.28,75.58 | v107.18,71.6 103.5,71.6 98.03,66.13 98.03,36.67 100.71,33.98 HDR2.10
  Bottom 0.254: v113.28,75.58 109.3,71.6 v107.18,71.6
A3_KEY  (via drill 0.35)
  Top 0.203: 132.57,34.36 132.57,34.89 R639.2 v132.51,36.82 v132.5,36.83 | 132.57,34.36 132.57,34.15 | 132.57,34.15 132.57,33.91 | 132.57,33.91 R652.2 | 132.81,34.15 140.83,34.15 R653.2 142.46,34.18 149.87,34.18 R654.2 | 132.78,34.15 132.57,34.15 | 132.57,34.36 132.78,34.15 | 132.78,34.15 132.81,34.15 | 132.81,34.15 132.57,33.91
  Top 0.254: HDR2.9 103.66,36.52 106.46,33.73 119.36,33.73 123.69,38.07 v123.69,38.23
  Bottom 0.203: v132.5,36.83 132.5,38.23 P6.P$1
  Bottom 0.254: P6.P$1 132.46,38.23 v123.69,38.23
A4/SDA  (via drill 0.3, 0.35)
  Top 0.203: v117.8,65.67 116.59,65.67 115.91,64.99 103.11,64.99 99.06,60.94 99.06,42.4 HDR2.8 | v56.13,54.18 56.13,59.83 v57.29,60.99
  Top 0.254: v44.97,48.64 45.84,47.77 45.84,47.01 33.49,34.66 U5.2
  Bottom 0.203: U2.P$15 v117.8,65.67 | HDR2.8 104.18,40.85 104.18,42.06 103.35,42.89 100.17,42.89 95.97,47.09 95.97,53.31 89.74,59.53 79.02,59.53 73.68,54.19 63.59,54.19 63.58,54.18 v56.13,54.18 50.6,48.65 U205.P$19 | U7.8 57.18,60.88 v57.29,60.99
  Bottom 0.254: R18.2 25.02,38.15 28.52,34.66 U5.2 | v44.97,48.64 v44.98,48.65 U205.P$19
A4/SDA_L  (via drill 0.3)
  Top 0.203: U3.14 62.72,57.6 61.61,58.71 v60.85,58.71 60.34,59.21 60.34,60.74 58.56,62.52 51.7,62.52 44.59,55.4 v44.59,54.64 | U1.4 44.25,52.54 v44.06,52.36
  Bottom 0.203: R29.2 62.13,59.99 v60.85,58.71 58.05,58.71 57.4,59.36 U7.5 | v44.06,52.36 44.08,52.36 44.59,52.86 v44.59,54.64
A5/SCL  (via drill 0.3, 0.35)
  Top 0.203: HDR2.7 99.75,44.25 99.75,60.69 103.43,64.37 v117.27,64.37 | v56.96,53.56 56.96,59.64 v58.31,60.99
  Top 0.254: v44.97,47.36 37.35,39.74 U5.4
  Bottom 0.203: v117.27,64.37 119.66,64.37 U2.P$14 | HDR2.7 99.87,41.6 95.14,46.34 95.14,53.12 89.3,58.96 79.39,58.96 73.99,53.56 v56.96,53.56 50.78,47.38 U205.P$18 | v58.31,60.99 58.56,60.99 58.67,60.88 U7.1
  Bottom 0.254: R19.2 U5.4 | v44.97,47.36 46.51,47.36 U205.P$18
A5/SCL_L  (via drill 0.3)
  Top 0.203: U3.13 63.22,58.88 v61.36,60.74 59.07,63.02 51.45,63.02 43.83,55.4 43.83,53.88 44.17,53.54 U1.6
  Bottom 0.203: R30.2 62.22,61.61 v61.36,60.74 61.36,59.98 60.74,59.36 U7.4
A6  (via drill 0.3)
  Top 0.203: v107.58,21.11 108.85,19.84 171.08,19.84 175.91,24.67 175.91,33.56 179.97,37.62 J18.3
  Bottom 0.203: v107.58,21.11 107.58,28.99 104.79,31.78 104.79,43.47 104.11,44.14 HDR2.6
A7  (via drill 0.3)
  Top 0.203: v108.35,22.38 110.38,20.35 170.83,20.35 175.4,24.92 175.4,35.08 179.94,39.62 J18.4
  Bottom 0.203: v108.35,22.38 108.35,29.24 105.3,32.29 105.3,44.99 103.6,46.68 HDR2.5
B  (via drill 0.3 pad 0.7)
  Top 0.254: v49.33,44.41 57.46,44.41 v61.41,40.46
  Bottom 0.254: U205.P$16 48.91,44.84 v49.33,44.41 | v61.41,40.46 61.45,40.42 61.45,35.99 P76.P$1 U215.7
C
  Bottom 0.254: U205.P$15 43.42,43.57 41.17,41.32 41.17,22.2 42.94,20.43 54.42,20.43 56.28,22.28 56.28,23.67 P77.P$1 56.33,25.93 U215.4
COM
  Top 1.016: RELAY1.2 20.33,110.12 J123.2
CS_3V
  Top 0.254: R24.1 65.34,55.9 64.93,56.31 64.27,56.31 U3.12
D
  Bottom 0.254: U205.P$14 43.74,42.3 41.94,40.49 41.94,23.31 43.71,21.53 50.01,21.53 51.26,22.79 P78.P$1 U215.2
D0/RX
  Bottom 0.203: HDR1.2 82.44,49.58 82.44,20.1 88.28,14.26 161.69,14.26 175.05,27.62 J17.4
D1/TX
  Bottom 0.203: HDR1.1 81.93,51.62 81.93,19.59 88.03,13.49 162.19,13.49 174.32,25.62 J17.3
D2_IR_R  (via drill 0.35)
  Top 0.203: v162.75,24.35 162.74,24.36 162.74,32.59 163.75,33.59 U309.3
  Top 0.254: R301.2 165.18,28.5 165.07,28.6 U309.3
  Bottom 0.203: v162.75,24.35 162.75,22.06 155.65,14.96 88.8,14.96 83.75,20.02 83.75,43.27 HDR1.5
D3_BUZZER
  Top 0.203: R284.1 30.95,77.84 44.38,91.27 82.59,91.27 92.14,81.72 92.14,73.95 92.14,73.81 92.14,47.07 89.21,44.14 HDR1.6
D4_RELAY
  Top 0.203: R274.2 52.43,111.3 58.18,105.55 58.18,98.52 65.03,91.67 82.89,91.67 92.73,81.83 92.73,73.69 92.73,73.67 92.73,45.88 88.45,41.6 HDR1.7
D6_US_TRIG
  Top 0.203: HDR1.9 83.82,39.86 83.82,41.71 64.75,60.77 J14.P$3
  Bottom 0.254: P37.P$1 64.2,67.72 64.75,68.28 J14.P$3
D7_US_ECHO  (via drill 0.35)
  Top 0.203: HDR1.10 88.7,33.98 89.04,34.32 89.04,36.86 88.03,37.88 86.5,37.88 84.22,40.16 84.22,42.07 66.06,60.23 v66.06,65.99 66.06,67.03 R299.2
  Bottom 0.254: P38.P$1 66.87,65.18 v66.06,65.99
D9_SERVO  (via drill 0.35)
  Top 0.203: v149.26,79.5 149.26,63.05 134.38,48.17 134.38,46.67 117.87,30.16 90.57,30.16 89.31,28.9 HDR1.12
  Bottom 0.203: J16.1 151.6,101.01 149.26,98.67 J3.1 v149.26,79.5 149.26,78.27 P93.P$1
DB4  (via drill 0.35)
  Top 0.254: v121.53,58.04 126.27,58.04 132.19,63.96 132.19,84.44 140.31,92.56 140.31,131.66 138.52,133.45 96.03,133.45 92.47,129.9 U8.P$11
  Bottom 0.254: v121.53,58.04 119.71,58.04 U2.P$9 | U8.P$11 92.44,127.67 P62.P$1
DB5  (via drill 0.35)
  Top 0.254: v121.94,59.35 126.59,59.35 131.63,64.39 131.63,84.7 139.91,92.98 139.91,131.37 138.24,133.04 98.66,133.04 95.01,129.39 U8.P$12
  Bottom 0.254: U2.P$10 119.72,59.35 v121.94,59.35 | U8.P$12 95.01,132.32 P63.P$1
DB6  (via drill 0.35)
  Top 0.254: v121.8,60.61 126.99,60.61 131.19,64.81 131.19,85.09 139.37,93.28 139.37,131.07 137.84,132.6 101.29,132.6 97.55,128.86 U8.P$13
  Bottom 0.254: v121.8,60.61 121.78,60.59 U2.P$11 | U8.P$13 97.52,127.67 97.52,132.48 P64.P$1
DB7  (via drill 0.35)
  Top 0.254: v122.09,61.86 127.23,61.86 130.72,65.35 130.72,85.2 138.88,93.36 138.88,130.52 137.29,132.11 103.5,132.11 100.09,128.71 U8.P$14
  Bottom 0.254: v122.09,61.86 U2.P$12 | P65.P$1 U8.P$14
DIG1
  Bottom 0.254: U205.P$2 54.64,48.65 52.58,46.58 52.58,32.12 51.44,30.99 49.53,30.99 48.73,31.79 U215.12 48.71,33.59 P84.P$1
DIG2
  Bottom 0.254: U205.P$3 55.58,47.38 54.34,46.14 54.34,38.12 56.36,36.1 P85.P$1 56.35,36.04 U215.9
DIG3
  Bottom 0.254: U215.8 P86.P$1 57.54,36.04 55.22,38.37 55.22,44.39 55.41,44.58 55.66,44.84 U205.P$5
DIG4
  Bottom 0.254: P87.P$1 U215.6 63.18,27.7 63.18,41.38 61.25,43.31 61,43.57 U205.P$6
DP  (via drill 0.3 pad 0.7)
  Top 0.254: v57.52,30.11 57.48,30.15 56.37,30.15 53.81,27.59 U215.3
  Bottom 0.254: U205.P$10 59.54,38.49 60.14,37.89 60.14,31.29 58.96,30.11 v57.52,30.11 | P82.P$1 U215.3
DVI  (via drill 0.3 pad 0.7)
  Top 0.254: v46.53,51.41 v46.54,51.42 C209.2 46.54,53.06 | 46.54,53.06 R271.2 | U1.5 46.51,53.04 46.54,53.06
  Bottom 0.254: v46.53,51.41 45.44,51.41 P51.P$1
E
  Bottom 0.254: U205.P$13 44.41,41.03 42.93,39.54 42.93,23.97 44.36,22.54 47.7,22.54 48.75,23.6 P79.P$1 48.74,25.94 U215.1
E_LCD  (via drill 0.35)
  Top 0.254: v130.98,60.58 132.67,62.27 132.67,84.22 140.74,92.29 140.74,131.88 138.68,133.95 85.17,133.95 79.77,128.55 U8.P$6
  Bottom 0.254: v130.98,60.58 129.31,60.58 U2.P$6 | U8.P$6 79.77,128.55 83.76,132.54 P60.P$1
F
  Bottom 0.254: P80.P$1 53.81,35.99 U215.10 53.85,33.53 53.85,30.78 53.45,30.38 46.73,30.38 45.76,31.35 45.76,35.26 48.14,37.64 48.14,39.37 47.75,39.76 U205.P$12
FB
  Bottom 0.5: C47.2 116.3,46.4 R75.1 R76.2 117.87,46.42 | 117.87,46.42 119.52,46.42 P4.P$1 | 117.87,46.42 117.89,46.4 U10.3
G
  Bottom 0.254: U205.P$11 45.19,38.49 44.01,37.3 44.01,30.2 45.74,28.46 57.69,28.46 58.89,27.27 U215.5 P81.P$1
GND  (via drill 0.3, 0.35)
  Bottom 0.203: J3.4 143.26,78.6 P94.P$1
  other vias: 21.78,130.86 34.08,130.64 11.09,121.49 11,117.6 10.95,111.87 52.77,121.86 52.42,119.13 52.23,106.54 52.1,112.88 57.01,94.81 23.46,72.83 30.13,68.86 35.87,67.29 72.86,96.33 85.39,93.5 76.02,65.48 53.48,57.3 72.81,67.66 32.1,46.96 22.04,59.5 39.34,44.87 34.1,37.62 78.19,68 42.19,58.78 63.52,52.83 16.45,20.07 26.67,20.4 21.04,24.04 21.46,17.91 16.98,13.94 21.57,7.44 30.68,6.97 33.25,15.23 41.79,13.8 51,14.37 51,6.11 60.97,5.83 53.06,48.44 58.69,46.96 65.3,45.62 70.77,49.38 51.37,45.97 111.3,66.29 111.57,70.13 116.04,69.89 120.17,73.41 141.59,63.97 145.45,64.54 139.2,61.76 145.24,62.04 103.58,82.59 108.13,89.15 112.05,88.89 120.79,88.98 141.51,74.77 141.27,80.44 141.23,83.93 142.68,84.13 141.28,78.06 143.84,84.07 175.29,70.56 175.29,101.4 151.65,119.68 147.81,120.27 154.52,118.77 145.48,118.23 147.23,122.25 173.98,113.22 148.3,130.85 170.7,130.62 123.89,127.85 136.17,122.79 116.01,128.24 121.13,129.42 62.82,135.14 54.48,131.09 98.93,93.5 95.91,87.97 71.13,58.68 84.71,70.2 163.94,79.01 162.34,79.01 160.64,78.46 160.54,76.01 155.24,75.61 165.94,74.76 165.89,73.26 153.55,88.61 151.59,95.46 143.14,94.96 140.14,90.41 156.59,87.96 146.88,109.58 145.73,109.63 144.13,108.33 144.23,106.13 145.18,104.98 175.49,81.66 176.79,88.06 71.78,44.82 63.32,54.81 10.81,100.36 13.35,90.46 21.99,90.2 31.38,90.2 29.86,72.93 11.57,67.34 21.48,63.79 15.89,55.15 9.03,48.8 16.14,41.43 32.91,36.1 28.08,37.88 11.06,33.31 58.05,51.34 59.32,52.61 66.94,52.61 76.34,46.01 69.23,41.69 66.44,40.16 69.48,35.59 73.55,39.4 78.12,36.61 70.75,29.75 76.6,31.53 77.87,23.91 65.42,17.81 74.06,15.27 82.44,12.73 92.6,12.22 103.27,11.97 111.65,10.7 109.11,17.56 98.44,18.32 97.17,23.4 93.36,22.89 91.33,21.88 122.32,9.68 133.75,4.86 141.62,7.91 150.51,5.11 159.65,6.89 172.1,6.38 174.64,16.29 176.93,40.67 183.78,22.13 165.5,26.45 161.43,27.46 161.69,30.51 150.76,21.88 158.38,21.88 180.99,31.78 175.4,36.1 143.4,22.13 136.79,22.13 130.95,22.13 125.87,27.46 124.35,28.48 121.55,27.72 119.01,25.94 117.49,22.13 119.52,17.05 124.6,22.13 130.44,17.56 122.32,38.39 119.27,36.35 183.02,40.16 175.66,46.77 183.78,49.56 177.18,57.44 183.53,64.04 172.1,67.85 159.4,67.6 153.56,67.6 154.83,63.53 154.07,57.18 152.29,56.17 145.18,56.42 138.06,54.39 134.76,55.66 92.6,43.72 91.84,36.86 95.39,38.13 96.92,49.82 96.15,56.42 95.65,60.48 89.55,60.74 100.22,65.82 96.41,66.07 90.31,65.56 99.71,72.42 96.15,75.22 52.21,114.84 46.88,102.65 47.64,101.38 25.29,75.98 30.88,79.53 30.62,83.09 61.61,48.29 63.13,48.29 89.55,49.31 84.98,49.31 80.41,53.63 80.15,52.36 117.74,49.56 119.01,49.31 116.98,45.24 116.98,43.21 118,42.96 112.41,39.4 111.9,38.64 111.65,37.62 169.31,45.24 163.46,40.93 164.29,42.82 181.56,43.33 167.84,35.45 157.78,75.61 174.29,84.5 57.71,126.41 55.93,125.14 65.07,128.19 65.07,127.17 79.04,135.3 111.55,129.46 126.79,129.46 132.89,129.46 142.54,134.54 143.56,127.17 143.3,121.08 136.19,115.74 136.19,110.92 136.19,104.82 136.19,98.73 142.54,112.95 142.29,104.57 133.14,90.85 136.19,85.77 46.79,87.86 63.3,88.37 79.55,88.62 88.44,79.48 112.66,35.59 115.71,42.7 109.36,50.32 109.62,51.34 109.62,52.61 110.38,53.63 69.76,68.42 96.15,17.81 112.41,16.03 86.76,19.34 120.79,36.86 121.55,37.88 109.62,42.7 107.58,37.12 104.79,50.32
  cutout Top: 14.91,120.97 44.47,120.97 44.47,100.28 14.9,100.28 14.9,120.97
  cutout Bottom: 14.9,120.95 44.47,120.95 44.47,100.26 14.9,100.26
  pour Bottom (rank 2): -4.43,142.27 -4.43,-2.51 193.69,-2.51 193.69,19.59 193.69,142.27
  pour Top (rank 2): -3.92,141.76 -3.92,-1.75 192.93,-1.75 192.93,141.76
IB  (via drill 0.3 pad 0.7)
  Top 0.254: U101.10 124.87,72.47 R108.2 125.06,71.56 v125.08,71.54
  Bottom 0.254: v125.08,71.54 125.08,70.46 P98.P$1
LED_G
  Bottom 0.254: R6.2 151.68,54.2 Q3.1 151.59,52.42 R9.1 148,52.42 P30.P$1
LED_R
  Bottom 0.254: R4.2 131.58,52.78 Q1.1 131.26,52.46 R5.1 P42.P$1
LED_Y
  Bottom 0.254: R1.2 141.75,52.73 Q2.1 141.5,52.48 R2.1 137.57,52.48 P7.P$1
LIGHT  (via drill 0.35)
  Top 0.254: v122.4,64.04 118.63,64.04 v117.14,62.55
  Bottom 0.254: P61.P$1 R321.2 115.72,62.55 v117.14,62.55 | U2.P$7 127.11,59.32 v122.4,64.04
N$1
  Top 0.254: U101.3 118.48,77.55 118.94,78.01 118.94,80.75 118.1,81.59 116.47,81.59 115.68,82.38 R111.1
N$2
  Bottom 0.254: R324.1 114.26,61.04 R321.1 116.5,60.25 116.5,58.7 Q108.1
N$3
  Top 0.254: R106.1 124.65,82.36 C225.2
N$4
  pour Bottom (no thermals): 108.85,46.26 113.17,46.26 114.19,45.24 115.71,45.24 116.22,44.74 116.22,43.72 115.97,43.47 108.85,43.47 108.35,43.97 108.35,45.75
N$5
  Bottom 0.254: D002.2 Q2.3
N$6
  Bottom 0.406: R28.2 117.89,40.64 U10.4
N$7
  Top 0.254: U8.P$3 72.15,129 70.96,130.2 62.4,130.2 61.14,128.94 R268.2
N$8
  Bottom 0.203: D002.1 140.01,46.55 R3.2
N$9
  Bottom 0.508: D005.2 152.53,50.38 Q3.3
N$10
  Bottom 0.254: R17.2 129.42,67.06 U2.P$1
N$11
  Bottom 0.254: U2.P$2 131.57,65.67 R87.2
N$12
  Bottom 0.254: U2.P$3 131.41,64.4 R89.2
N$13
  pour Bottom: 160.12,76.57 160.12,77.75 159.88,77.99 158.42,77.99 157.19,79.22 157.19,81.44 156.83,81.8 155.18,81.8 154.65,81.27 154.65,77.33 155.6,76.38 159.93,76.38
N$14
  Bottom 0.508: R11.2 149.99,46.47 D005.1
N$15
  Bottom 0.254: D11.2 132.41,48.43 Q1.3
N$16
  Bottom 0.254: D11.1 129.99,46.31 R7.2
N$17
  Bottom 1: TEST_PIN1.2 94.39,20.62 95.14,21.37 97.93,21.37 100.73,18.57 R31.1
N$19
  Bottom 1: R13.1 101.66,57.58 HDR2.1
N$20  (via drill 0.35)
  Top 0.254: v117.49,59.99 120.19,62.69 127.37,62.69 130.31,65.63 130.31,85.44 138.47,93.6 138.47,130.18 137.02,131.63 107.4,131.63 105.17,129.41 U8.P$16
  Bottom 0.254: v117.49,59.99 117.49,58.61 Q108.3
N$24
  Bottom 0.203: U7.6 53.33,59.87 R14.2 53.23,58.36 R12.2
N$25
  Top 0.254: U101.6 115.36,73.74 R110.2
N$29
  Top 0.254: R109.2 121.27,67.62 123.15,69.49 U101.9
N$35
  Top 0.254: R103.1 119.51,85.17 121.39,85.17 C103.1
N$36
  Bottom 0.203: 163.1,77.95 R10.1 | R8.2 163.1,76.45 163.1,77.95 | 163.05,78 163.1,77.95
  Bottom 0.5: U4.3 161.56,77.85 161.71,78 163.05,78
N$37
  Top 0.254: U101.1 117.51,80.39 R113.2
N$39
  Top 0.254: R104.1 108.8,85.88 106,88.67 R15.1
N$40
  Bottom 0.254: R16.1 C26.1 167.47,39.86 170.83,43.22 170.99,43.38 J19.1
N$41
  Bottom 0.254: U6.5 160.76,43.51 R20.2 160.76,39.88 C26.2
N$42  (via drill 0.35)
  Top 0.203: R23.2 164.81,43.68 R21.2 162.82,44.81 v162.74,44.9
  Bottom 0.203: v162.74,44.9 160.87,44.9 U6.6
N$43  (via drill 0.35)
  Top 0.254: v167.49,62.92 166.95,63.46 D1.1
  Bottom 0.203: U6.1 167.52,47.39 167.79,47.39 167.79,46.29 167.52,46.02 166.16,46.02 U6.2
  Bottom 0.254: v167.49,62.92 168.15,62.26 168.15,47.75 167.79,47.39
N$44  (via drill 0.35)
  Top 0.254: R23.1 165.86,42.68 167.51,42.68 168.02,43.19 v168.02,43.83
  Bottom 0.203: U6.3 164,44.85 162.73,46.12 U6.7
  Bottom 0.254: v168.02,43.83 168.02,44.28 167.44,44.85 U6.3
N$45
  Top 0.254: U3.2 61.33,55.1 60.72,54.49 60.72,51.58 R26.2
N$46
  Top 0.254: U3.3 61.61,54.6 61.23,54.22 61.23,52.6 62.94,50.89 R27.2
N$166
  Top 0.203: K1.P$2 134.09,30.99 R652.1
N$168
  Top 0.203: K2.P$2 145.21,31.29 R653.1
N$169
  Top 0.203: K3.P$2 154.22,31.35 R654.1
N$258
  Top 0.254: R238.2 R237.1 U1.2
N$259
  Top 0.508: R274.1 R273.2 48.51,114.28 Q115.1
N$278
  Top 0.254: R299.1 67.63,70.13 J14.P$2
N$279
  Top 0.508: Q103.1 27.42,80.95 R302.2 27.42,77.87 R284.2
N$280
  Top 0.508: BUZ1.2 14.32,83.77 17.46,86.91 28.05,86.91 28.64,86.32 D004.+ 28.64,83.66 Q103.3
N$281
  Top 0.508: R303.2 25.31,85.2 D004.- 21.91,85.23 20.82,84.14 BUZ1.1
NC
  Top 1.016: J123.1 25.69,106.64 RELAY1.4
NO
  Top 1.016: RELAY1.5 25.73,113.64 J123.3
PIR  (via drill 0.3 pad 0.7)
  Top 0.254: U101.2 R112.2 115.04,78.83 v113.81,78.83
  Bottom 0.254: P96.P$1 112.66,78.83 v113.81,78.83
RC1  (via drill 0.3 pad 0.7)
  Top 0.254: U101.4 118.59,76.28 119.41,77.09 v119.41,81.35 119.41,82.06 C108.1 R111.2
  Bottom 0.254: P104.P$1 117.55,81.35 v119.41,81.35
RC2  (via drill 0.3 pad 0.7)
  Top 0.254: C107.1 115.3,72.26 R110.1 | C107.1 113.7,74.09 114.61,75.01 U101.5 | C107.1 113.67,72.28 v112.68,72.28
  Bottom 0.254: v112.68,72.28 P105.P$1
RED  (via drill 0.35)
  Top 0.254: D130.2 R307.1 | R307.1 | v110.63,61.5 v110.62,61.51 R307.1
  Bottom 0.254: P5.P$1 v110.64,61.51 v110.63,61.5
RS  (via drill 0.35)
  Top 0.254: v83.81,134.04 79.95,130.18 75.74,130.18 74.69,129.13 U8.P$4
  Bottom 0.254: U2.P$4 133.88,63.13 134.16,63.41 134.16,67.67 131.11,70.72 131.11,85.92 137.4,92.21 137.4,130.03 132.67,134.76 84.53,134.76 v83.81,134.04 | P58.P$1 74.69,129.66 U8.P$4
RW
  Bottom 0.203: P59.P$1 77.23,129.29 U8.P$5
  Bottom 0.254: U2.P$5 133.53,61.86 134.57,62.9 134.57,67.83 131.51,70.89 131.51,85.68 137.8,91.97 137.8,130.21 132.77,135.24 83.19,135.24 P59.P$1
S  (via drill 0.3 pad 0.7)
  Top 0.254: R101.2 125.13,75.83 C101.2 | C101.2 126.57,75.93 R102.2 | C101.2 127.95,75.83 v127.96,75.84
  Bottom 0.254: P95.P$1 129.27,75.84 v127.96,75.84 126.65,74.53 115.4,74.53 111.14,78.79 J101.2
SDO
  Top 0.254: R25.1 60.22,51.48 60.22,54.63 61.19,55.6 U3.1
SEN_3V3  (via drill 0.3, 0.35)
  Top 0.203: C14.2
  Top 0.254: U1.1 40.95,53.54 C14.2 | 64.38,51.65 U3.8 | 64.38,51.65 63.38,51.65 62.72,52.31 U3.5 | 64.38,51.65 64.38,49.8 64.79,49.39 R24.2 67.1,49.39 C29.2 67.12,46.83 67.14,46.81
  Top 0.5: C14.2 38.58,53.03 R237.2 | v40.02,55.66 C14.2
  Top 1: R271.1 v50.43,53.93 | v50.43,53.93 | v50.43,53.93 54.96,49.4 R25.2 59.66,47.71 60.56,46.81 67.14,46.81 72.31,46.81 81.03,38.09 81.03,20.03 84.58,16.48 98.89,16.48 100.07,17.65 100.07,23.06 100.83,23.82 HDR2.14
  Bottom 0.203: U7.3 60.49,59.87 60.59,59.98 60.59,61.75 61.36,62.52 63.64,62.52 63.78,62.38 R30.1 | 63.78,60 R29.1 | 63.78,58.36 C17.1 | 51.7,56.17 51.7,56.21
  Bottom 0.5: R30.1 63.78,60 | R29.1 63.78,58.36 | C17.1 63.8,57.34 62.63,56.17 51.7,56.17 50.43,56.17 | 51.7,56.21 R12.1 | 50.43,56.17 v50.43,53.93 | v40.02,55.66 40.53,56.17 50.43,56.17
  Bottom 1: v50.43,53.93 P49.P$1
USB_D_N
  Bottom 0.203: J6.1 126.97,29.5 125.56,30.91 121.05,30.91 120.23,30.09 J8.3 116.42,30.09 115.59,30.91 115.18,30.91 114.47,30.2 114.47,20.78 109.81,16.12 91.37,16.12 90.22,17.27 90.22,18.1 TEST_PIN1.4
USB_D_P
  Bottom 0.203: J5.1 127.09,32.78 125.59,31.27 121.05,31.27 120.23,32.09 J8.2 116.42,32.09 115.59,31.27 115.03,31.27 114.11,30.35 114.11,20.92 109.66,16.47 91.58,16.47 90.58,17.47 90.58,18 TEST_PIN1.3
V+
  Top 0.508: RELAY1.1 44.23,104.12 48.51,108.4 R276.2
V-
  Top 0.508: RELAY1.3 40.91,116.62 45.58,116.62 D006.+ 49.15,116.62 Q115.3
VCC_5V  (via drill 0.3, 0.35, 0.5)
  Top 0.203: 108.69,67.71 108.6,67.62 | v180.22,67.09 | U309.1 | C25.2
  Top 0.254: D130.1 107.41,61.3 v107.47,61.25
  Top 0.5: U101.11 122.3,73.74 119.76,71.2 U101.8 117.81,67.92 R109.1 108.6,67.62 107.09,67.62 106.98,67.72 C102.2 105.68,67.72 v105.55,67.6 | 108.69,67.71 J101.1 106.82,77.11 106.82,79.53 107.67,80.39 R113.1 | R301.1 166.7,27.02 167.02,26.7 169.56,26.7 170.15,27.3 C214.2 | C214.2 U309.1 | C214.2 172.21,28.33 172.86,28.99 v172.86,36.86
  Top 0.508: C35.2 50.33,103.27 L11.1 | R303.1 25.31,79.43 C19.1 | R639.1 157.23,34.95 v157.62,35.34
  Top 1: R268.3 v64.29,125.29 | L11.1 v55.87,104.61 v55.88,104.6 | R303.1 v23.55,81.22 | C25.2 v180.22,67.09 | P1.3 C25.2
  Bottom 0.203: U7.7 54.86,60.38 54.5,60.74 54.5,61.25 54.1,61.65 C18.2 | P36.P$1 61.58,65.09 61.39,65.09 | P97.P$1 | 157.62,36.37 157.78,36.53 | 175.4,38.14 | 53.23,65.09 | P1.3 | C16.2 116.98,66.91 | 22.95,32.16 23,32.11 | 40.77,49.89 P83.P$1
  Bottom 0.254: 160.81,47.41 U6.8 | R19.1 26.48,41.28 R18.1 21.67,41.28
  Bottom 0.305: R17.1 132.1,68.1 122.77,68.1 121.61,66.94 U2.P$16 119.67,66.91 116.98,66.91 | C16.2 116.6,68.43 116.08,68.95 107.47,68.95
  Bottom 0.5: C47.1 114.82,47.94 R75.2 | v105.55,67.6 107.47,67.6 | P36.P$1 61.74,69.99 J14.P$4 | J101.1 P97.P$1 | U309.1 170.15,36.84 | v172.86,36.86 172.86,38.14 | C18.2 53.23,65.09 | P89.P$1 P1.3 | P54.P$1 22.95,32.16 | P73.P$1 40.77,49.89
  Bottom 0.508: R16.2 159.71,38.31 158.13,39.89 158.13,46.43 159.16,47.46 160.76,47.46 160.81,47.41 | v157.62,35.34 157.62,36.37
  Bottom 0.762: R89.1 133.16,64.18 R87.1 133.14,65.63 R17.1
  Bottom 1: 21.67,41.28 21.64,41.26 | 21.64,41.26 20.63,40.25 20.63,33.37 21.89,32.11 23,32.11 C37.2 30.59,32.11 U5.1 | 55.88,102.98 v55.88,104.6 55.88,121.84 59.33,125.29 v64.29,125.29 69.59,125.29 | 69.59,125.29 101.67,125.29 102.63,126.25 U8.P$15 P3.P$1 | 55.88,102.98 66.03,92.83 83.59,92.83 107.47,68.95 107.47,67.6 107.47,63.7 | 112.42,54.72 C7.2 | 107.47,63.7 v107.47,61.25 107.47,59.67 112.42,54.72 | U8.P$2 69.61,125.31 69.59,125.29 | 26.15,54.79 21.64,50.29 21.64,41.26 | U205.P$20 46.52,49.93 C6.2 43.74,49.96 P83.P$1 30.98,49.96 26.15,54.79 | P3.P$1 | 98.19,63.7 107.47,63.7 | 160.71,36.53 166,36.53 167.61,38.14 172.86,38.14 175.4,38.14 177.91,35.62 J18.2 182.49,35.62 183.28,34.83 183.28,24.42 182.48,23.62 J17.2 | 160.71,36.53 157.78,36.53 150.82,43.49 | 150.82,43.49 142.03,43.49 | 142.03,43.49 132.38,43.49 | 132.38,43.49 129.89,43.49 P40.P$1 118.66,54.72 112.42,54.72 | R16.2 160.73,36.55 160.71,36.53 | R11.1 152.23,44.9 150.82,43.49 | R3.1 142.13,43.59 142.03,43.49 | R7.1 132.22,43.64 132.38,43.49 | v23.55,81.22 31.34,81.22 53.1,102.98 55.88,102.98 | 98.19,63.7 63.55,63.7 62.15,65.09 61.39,65.09 53.23,65.09 36.45,65.09 26.15,54.79 | 170.15,36.84 P48.P$1 | v180.22,67.09 180.22,49.05 175.4,44.23 175.4,38.14 | HDR2.4 100.81,49.22 98.19,51.85 98.19,63.7
  pour Bottom: 108.41,47.14 116.54,47.14 116.76,47.36 116.76,49.36 112.92,53.21 111.8,53.21 111.66,53.07 111.66,49.38 111.44,49.17 108.45,49.17 108.26,48.97 108.26,47.29
VCC_5V_SERVO
  Bottom 0.203: 168.81,82.65 C31.+ | J3.3 P92.P$1
  Bottom 0.5: C60.2 164.75,81.31 166.21,79.85 166.21,76.7 165.91,76.4 R8.1
  Bottom 0.8: J3.3 145.26,101.5 149.06,105.3 J16.2 149.06,110.2 149.71,110.85 154.91,110.85 155.91,109.85 155.91,90.9 159.16,87.65 165.78,87.65 169.21,84.22 C31.+ | D3.- 154.46,71.55 153.36,72.65 153.36,81.15 155.11,82.9 158.11,82.9 159.66,81.35 D008.C 159.9,80.45 160.76,81.31 C58.2 C59.2 C60.2 164.66,81.86 165.45,82.65 168.81,82.65
VCC_RELAY
  Top 0.508: D006.- 46.48,111.37 47.58,110.27 49.34,110.27 50.03,109.58 R276.1 50.03,108.39 48.51,106.87 C36.2 48.33,106.08 L11.2
VIN  (via drill 0.51)
  Top 1: v150.14,40 152.39,40 158.54,46.15 158.54,55.76 160.9,58.12 167.8,58.12 170.03,60.35 170.03,64.05 163.04,71.04 v163.04,71.9
  Bottom 0.203: 109.62,20.39 109.87,20.64
  Bottom 1: 109.62,20.39 107.8,18.57 R31.2 | R13.2 104.09,59.52 106.89,56.72 106.89,42.88 108.6,41.17 109.87,41.17 109.87,41.16 | C51.2 114.89,38.71 119.4,38.71 120.69,40 v150.14,40 | v163.04,71.9 163.15,72.01 C55.2 | L8.1 109.87,41.16 | 109.87,20.64 109.87,40.91 109.87,41.16
  pour Bottom: 110.89,41.91 114.04,41.91 114.89,41.07 116.32,41.07 116.5,41.25 116.5,42.19 116.66,42.35 117.23,42.35 117.42,42.16 117.42,34.8 117.2,34.59 114.24,34.59 114.11,34.72 114.11,39.83 113.85,40.09 110.83,40.09 110.61,40.31 110.61,41.63
  pour Bottom: 163.84,75.09 163.84,71.49 163,70.65 159.66,70.65 159.32,70.99 159.32,71.68 158.1,72.9 154.79,72.9 154.54,73.15 154.54,74.46 154.92,74.84 158.11,74.84 159.18,73.78 159.99,73.78 160.18,73.97 160.18,75.1 160.42,75.34 163.59,75.34
  pour Bottom: 114.35,34.96 125.27,34.96 127.29,36.98 131.35,36.98 131.8,36.53 131.8,34.53 131.54,34.27 127.44,34.27 126.53,33.36 114.36,33.36 114.11,33.61 114.11,34.71
~D5_LED_R  (via drill 0.35)
  Top 0.203: v127.96,49.17 127.96,41.27 119.44,32.75 97.68,32.75 91.36,39.06 HDR1.8
  Bottom 0.203: v127.96,49.17 127.96,50.28 128.62,50.94 R5.2
~D10_LED_Y  (via drill 0.35)
  Top 0.203: v138.21,50.07 138.21,49.67 117.27,28.73 105.3,28.73 104.19,27.63 90.73,27.63 89.47,26.36 HDR1.13
  Bottom 0.203: v138.21,50.07 139.1,50.96 R2.2
~D11_LED_G  (via drill 0.35)
  Top 0.203: v147.89,50.23 140.55,42.89 132.13,42.89 116.95,27.71 105.94,27.71 103.34,25.11 90.82,25.11 89.54,23.82 HDR1.14
  Bottom 0.203: R9.2 148.56,50.9 v147.89,50.23

## Text on the board
tPlace: A4/SDA | A5/SCL | D4 | NO | COM | NC | Relay | LCD | ADD:0X27 | D9 | Servo / Motor | D3 | TR-D6 | A2 | EC-D7 | A0 | Buzzer | Ultrasonic Ranging | PIR | Linear Potentiometer | PWR | A1 | A4/SDA | 1 | LED | A4/SDA | A5/SCL | A5/SCL | D1/TX | VIN | ADD:0X5C | D0/RX | GND | 3-Axis | RST | BOOT | Red | Yellow | Green | Light | GND | +5V | ADD:0X6B | A4/SDA | D2 | A7 | A5/SCL | ADD:0X38 | ~D3 | A6 | D5 | D10 | D11 | Sound | IO | D4 | A5/SCL | ~D5 | A4/SDA | A7 | A6 | ~D6 | A3 | D2 | A3 | 5V | D7 | A2 | GND | D8 | A1 | ~D9 | A0 | RX | ~D10 | ARFE | TX | K1 | K2 | K3 | Temperature / & Humidity | ~D11 | +3V3 | 5V | ADD:0X70 | A4/SDA | GND | D12 | D13 | 4-Digital Display | A5/SCL | Button | IR | D- | D+ | VBUS | GND | All-in-one Starter Kit for Arduino Nano R4 V1.0
bPlace: GND | VCC_5V_SERVO | D9 | GND | VCC_5V_SERVO | D9 | VIN | USB_D+ | USB_D- | GND
bNames: U2
tValues: 1*15P-2.54mm 排母 | 1*15P-2.54mm 排母 | 2.0mm-4P 直插 | 贴片硅胶无声按键 | 贴片硅胶无声按键 | 贴片硅胶无声按键 | 2.0mm-4P 直插 | 4个弹簧顶针
bValues: 2.00mm-4P带连接器 | PCF8574DWR